# Altium schematic sheet Diagrama en bloques Levitador GMI.SchDoc
size A4
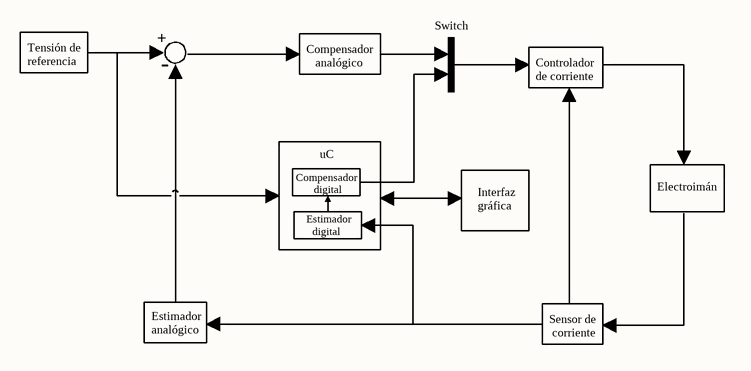
[diagram p0: Diagrama en bloques Levitador GMI.SchDoc]

## Notes on the sheet
- +
- Switch
- Tensión de
  referencia
- -
- Compensador
  analógico
- Controlador
  de corriente
- uC
- Compensador
  digital
- Estimador
  digital
- Interfaz
  gráfica
- Electroimán
- Estimador
  analógico
- Sensor de
  corriente